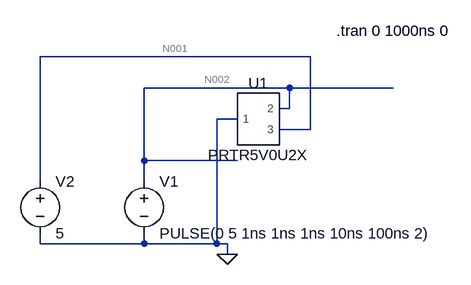
[diagram p0: schematic Draft1.asc]
Draft1.asc, the LTspice schematic file:
Version 4
SHEET 1 880 680
WIRE 272 -16 -144 -16
WIRE 240 32 16 32
WIRE 400 32 240 32
WIRE 240 64 240 32
WIRE 240 64 224 64
WIRE 160 80 128 80
WIRE 272 96 272 -16
WIRE 272 96 224 96
WIRE 16 144 16 32
WIRE 160 144 16 144
WIRE -144 176 -144 -16
WIRE 16 176 16 144
WIRE -144 272 -144 256
WIRE 16 272 16 256
WIRE 16 272 -144 272
WIRE 128 272 128 80
WIRE 128 272 16 272
WIRE 144 272 128 272
WIRE 144 288 144 272
FLAG 144 288 0
SYMBOL voltage 16 160 R0
WINDOW 123 0 0 Left 0
WINDOW 39 0 0 Left 0
SYMATTR InstName V1
SYMATTR Value PULSE(0 5 1ns 1ns 1ns 10ns 100ns 2)
SYMBOL voltage -144 160 R0
SYMATTR InstName V2
SYMATTR Value 5
SYMBOL PRTR5V0U2X 192 80 R0
SYMATTR InstName U1
TEXT 312 -56 Left 2 !.tran 0 1000ns 0

The netlist it stands for:
* Draft1.asc
V1 N002 0 PULSE(0 5 1ns 1ns 1ns 10ns 100ns 2)
V2 N001 0 5
XU1 0 N002 N001 PRTR5V0U2X  ; pins 1 2 3
.tran 0 1000ns 0
.lib C:\Jeonghyun\GIT\RFSoC_FrontEnd\Simulation\SpartanSim\ESD\PRTR5V0U2X.lib
.backanno
.end

* Results of the author's LTspice run, read from the files saved beside the schematic
* Operating Point, zero values left out:
*   V(n001) = 5 V
*   I(V2) = -8.275 A
*   Ix(u1:1) = -8.275 A
*   Ix(u1:3) = 8.275 A
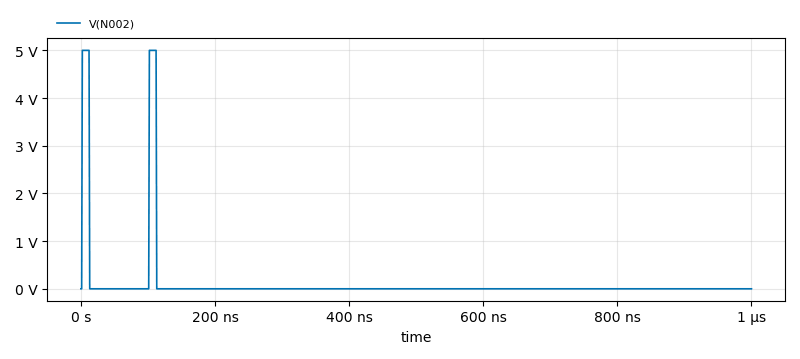
[diagram p1: Transient Analysis of Draft1.asc, plotted from the saved traces]
* Transient Analysis, 1 run:
*   V(N002): min 0 V, max 5 V, average 110 mV, rms 730.9 mV, last 0 V